# EAGLE schematic Batterie (EAGLE 7.6.0)
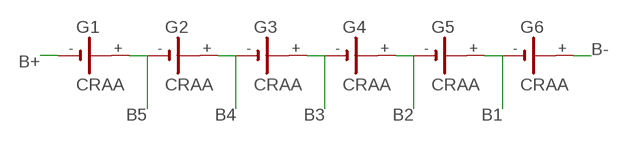
[diagram p0: schematic, sheet 1]

## Parts
G1  CRAA  [CRAA]
G2  CRAA  [CRAA]
G3  CRAA  [CRAA]
G4  CRAA  [CRAA]
G5  CRAA  [CRAA]
G6  CRAA  [CRAA]

## Nets
B1: G5.+ G6.-
B2: G4.+ G5.-
B3: G3.+ G4.-
B4: G2.+ G3.-
B5: G1.+ G2.-
B+: G1.-
B-: G6.+
Unconnected: G1.+@1(+) G2.+@1(+) G3.+@1(+) G4.+@1(+) G5.+@1(+) G6.+@1(+)

## Library data of the parts
G1-G6 = battery:CRAA: LI BATTERY Varta